# EAGLE design FREENFET3 (EAGLE 6.5.0)
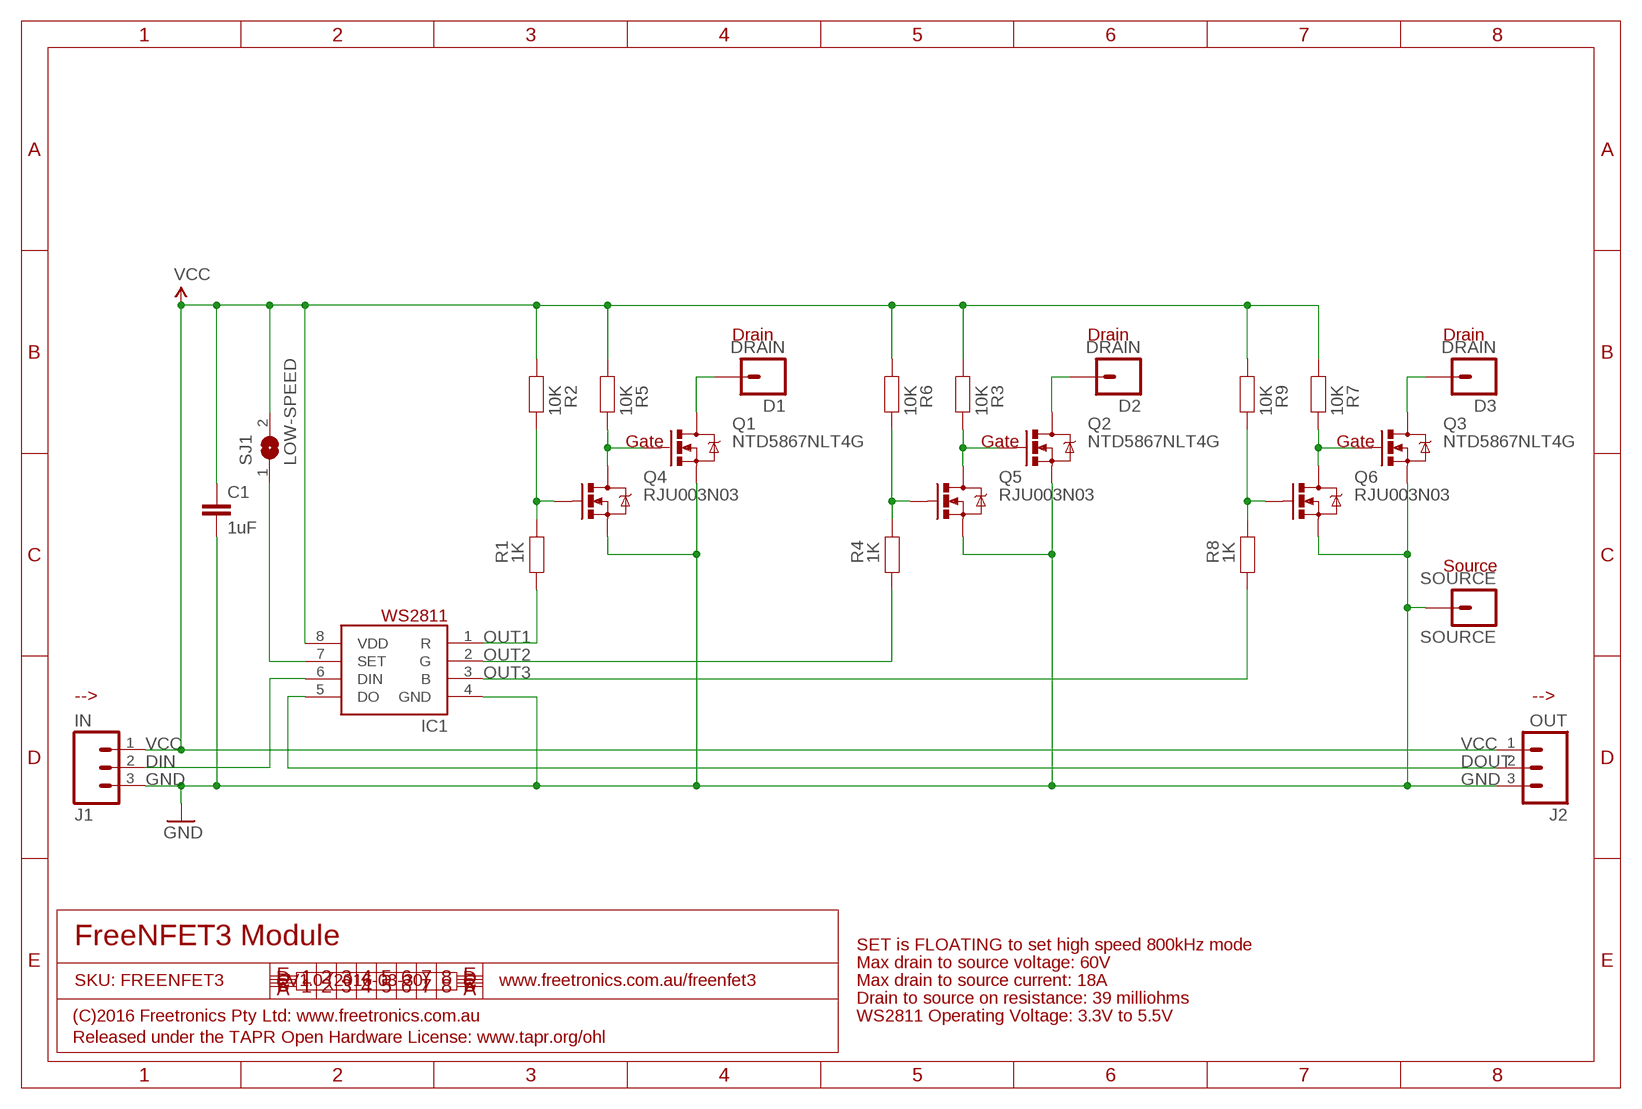
[diagram p0: schematic, sheet 1]

## Parts
C1  1uF  CAP0603  [0603]
D1  DRAIN  M01PTH_LARGE  [1X01LARGE]
D2  DRAIN  M01PTH_LARGE  [1X01LARGE]
D3  DRAIN  M01PTH_LARGE  [1X01LARGE]
IC1  WS2811-SOP8  [SO08-SKINNYPADS]
J1  IN  M03PTH  [1X03]
J2  OUT  M03PTH  [1X03]
Q1  NTD5867NLT4G  MOSFET-NCHANNELDPAK  [DPACK]
Q2  NTD5867NLT4G  MOSFET-NCHANNELDPAK  [DPACK]
Q3  NTD5867NLT4G  MOSFET-NCHANNELDPAK  [DPACK]
Q4  RJU003N03  MOSFET-NSOT-323  [SOT32-3]
Q5  RJU003N03  MOSFET-NSOT-323  [SOT32-3]
Q6  RJU003N03  MOSFET-NSOT-323  [SOT32-3]
R1  1K  RESISTOR0603  [0603]
R2  10K  RESISTOR0603  [0603]
R3  10K  RESISTOR0603  [0603]
R4  1K  RESISTOR0603  [0603]
R5  10K  RESISTOR0603  [0603]
R6  10K  RESISTOR0603  [0603]
R7  10K  RESISTOR0603  [0603]
R8  1K  RESISTOR0603  [0603]
R9  10K  RESISTOR0603  [0603]
SJ1  LOW-SPEED  SJN  [SJ]
SOURCE  SOURCE  M01PTH_LARGE  [1X01LARGE]

## Nets
D: D1.1 Q1.2(D)
D1: D2.1 Q2.2(D)
D2: D3.1 Q3.2(D)
DIN: IC1.6(DIN) J1.2
DOUT: IC1.5(DO) J2.2
GND: C1.2 IC1.4(GND) J1.3 J2.3 Q1.3(S) Q2.3(S) Q3.3(S) Q4.2(S) Q5.2(S) Q6.2(S) SOURCE.1
N$1: Q2.1(G) Q5.3(D) R3.1
N$2: Q4.1(G) R1.1 R2.1
N$3: Q1.1(G) Q4.3(D) R5.1
N$4: Q5.1(G) R4.1 R6.1
N$5: Q3.1(G) Q6.3(D) R7.1
N$6: Q6.1(G) R8.1 R9.1
N$7: IC1.7(SET) SJ1.1
OUT1: IC1.1(R) R1.2
OUT2: IC1.2(G) R4.2
OUT3: IC1.3(B) R8.2
VCC: C1.1 IC1.8(VDD) J1.1 J2.1 R2.2 R3.2 R5.2 R6.2 R7.2 R9.2 SJ1.2

## Notes on the sheet
- Drain | Drain | Drain
- Gate | Gate | Gate
- Source
- --> | -->
- FreeNFET3 Module
- SET is FLOATING to set high speed 800kHz mode
- Max drain to source voltage: 60V
- SKU: FREENFET3 | V1.0 (2016-03-30) | www.freetronics.com.au/freenfet3 | Max drain to source current: 18A
- Drain to source on resistance: 39 milliohms
- (C)2016 Freetronics Pty Ltd: www.freetronics.com.au | WS2811 Operating Voltage: 3.3V to 5.5V
- Released under the TAPR Open Hardware License: www.tapr.org/ohl

## Library data of the parts
C1 = freetronics-master-v1:CAP: Capacitor Standard 0603 ceramic capacitor, and 0.1" leaded capacitor.
D1-D3 SOURCE = freetronics-master-v1.1:M01: Header 1 Standard 1-pin 0.1" header. Use with straight break away headers (SKU : PRT-00116), right angle break away headers (PRT-00553), swiss pins (PRT-00743), machine pins (PRT-00117), and female headers (PRT-00115).
IC1 = freetronics-jon:WS2811
J1 J2 = freetronics-jon:M03: Header 3 Standard 3-pin 0.1" header. Use with straight break away headers (SKU : PRT-00116), right angle break away headers (PRT-00553), swiss pins (PRT-00743), machine pins (PRT-00117), and female headers (PRT-00115). Molex polarized connector foot print use with SKU : PRT-08232 with associated crimp pins and housings.
Q1-Q3 = freetronics-master-v1.1:MOSFET-NCHANNEL
Q4-Q6 = freetronics-jon:MOSFET-N: Basic N-Channel MOSFET
R1-R9 = freetronics-master-v1:RESISTOR: Resistor Basic schematic elements and footprints for 0603, 1206, and PTH 1/10th watt (small) resistors.
SJ1 = freetronics-jon:SJ: SMD solder JUMPER

## Board
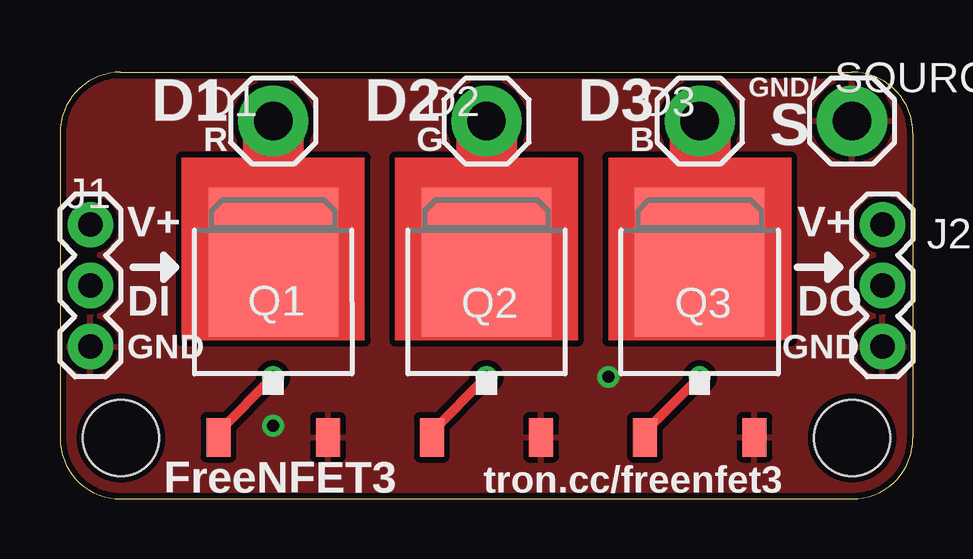
[diagram p1: board, top side]
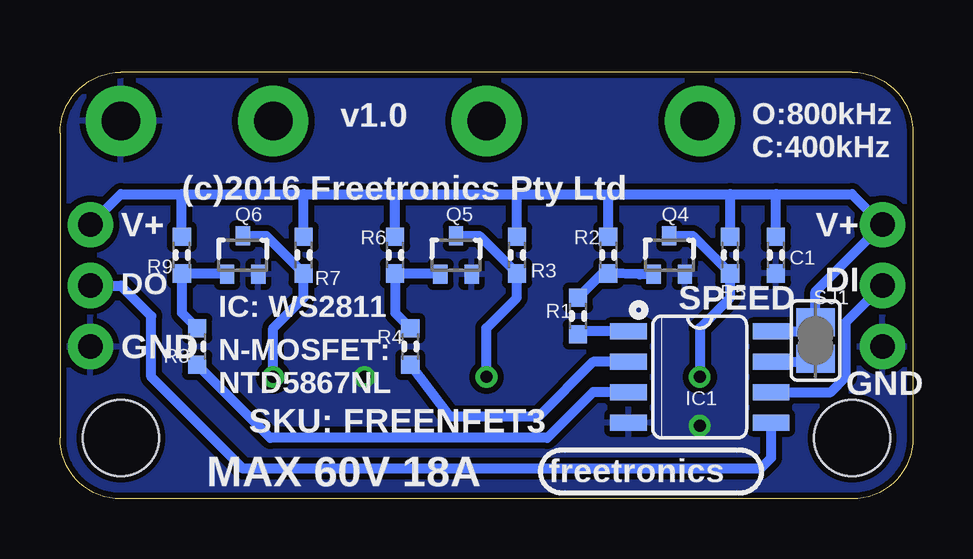
[diagram p2: board, bottom side, seen from below]

Size 35.56 x 17.78 mm. Coordinates in mm from the lower left corner, seen from the top.
Outline: 0,2.54 arc90 2.54,0 33.02,0 arc90 35.56,2.54 35.56,15.24 arc90 33.02,17.78 2.54,17.78 arc90 0,15.24 0,2.54
Copper layers (1*16): Top 0.035mm / dielectric 1.5mm / Bottom 0.035mm
Design rules "default *": minimum track width 8mil, minimum drill 15mil, track to track 10mil, track to pad 10mil, pad to pad 10mil, via to via 10mil, smd to smd 8mil, copper to edge 10mil, drill to drill 8mil, minimum pad ring 14mil, minimum via ring 8mil, stop-mask expansion 4mil, vias tented up to drill 25mil, thermal gap 10mil
Holes 3.17 mm at 2.54,2.54 33.02,2.54

### Footprints (pad centres in the part's own frame; a part is rotated, then mirrored left to right if it is on the bottom)
0603 = smd 0.762 x 0.762: 1 -0.762,0; 2 0.762,0
1X01LARGE = drill 1.6 pad 2.921: 1 0,0
SO08-SKINNYPADS = smd 0.66 x 1.524: 1 -1.905,-2.973; 2 -0.635,-2.973; 3 0.635,-2.973; 4 1.905,-2.973; 5 1.905,2.973; 6 0.635,2.973; 7 -0.635,2.973; 8 -1.905,2.973
1X03 = drill 1.016 pad 1.88: 1 0,0; 2 2.54,0; 3 5.08,0
DPACK = smd 1 x 1.6: 1 -2.28,-4.8; 3 2.28,-4.8 | smd 5.4 x 6.2: 2 0,2.5
SOT32-3 = smd 0.6 x 0.8: 1 -0.65,-0.8; 2 0.65,-0.8; 3 0,0.8
SJ = smd 1.168 x 1.6: 1 -0.762,0; 2 0.762,0

### Placement (x,y rotation side)
C1  5.71,10.16 270 bottom
D1  8.89,15.75 0 top
D2  17.78,15.75 0 top
D3  26.67,15.75 0 top
IC1  8.89,5.08 270 bottom
J1  1.27,11.43 270 top
J2  34.29,11.43 270 top
Q1  8.89,7.37 0 top
Q2  17.78,7.37 0 top
Q3  26.67,7.37 0 top
Q4  10.16,10.16 0 bottom
Q5  19.05,10.16 0 bottom
Q6  27.94,10.16 0 bottom
R1  13.97,7.62 270 bottom
R2  12.7,10.16 90 bottom
R3  16.51,10.16 90 bottom
R4  20.95,6.35 270 bottom
R5  7.62,10.16 90 bottom
R6  21.59,10.16 90 bottom
R7  25.4,10.16 90 bottom
R8  29.84,6.35 270 bottom
R9  30.48,10.16 90 bottom
SJ1  4.06,6.6 90 bottom
SOURCE  33.02,15.75 0 top

### Tracks (layer width: path | path; a pad name or v marks a point on that pad's centre or on a via)
D
  Top 0.305: 8.89,11.43 Q1.2
  Top 2.54: D1.1 8.89,11.43
D1
  Top 2.54: D2.1 Q2.2
D2
  Top 2.54: D3.1 Q3.2
DIN
  Bottom 0.406: IC1.6 3.43,4.45 2.79,5.08 2.79,7.37 J1.2
DOUT
  Bottom 0.406: IC1.5 5.92,1.7 6.35,1.27 27.94,1.27 31.75,5.08 31.75,7.62 33.02,8.89 J2.2
GND  (via drill 0.5)
  other vias: 8.89,3.05 22.86,5.08
  pour Top: 0,15.24 arc-90 2.54,17.78 33.02,17.78 arc-90 35.56,15.24 35.56,2.54 arc-90 33.02,0 2.54,0 arc-90 0,2.54
  pour Bottom: 0,15.24 arc-90 2.54,17.78 33.02,17.78 arc-90 35.56,15.24 35.56,2.54 arc-90 33.02,0 2.54,0 arc-90 0,2.54
N$1  (via drill 0.5)
  Top 0.406: Q2.1 15.5,2.8 v17.78,5.08
  Bottom 0.406: Q5.3 18.07,10.96 R3.1 16.51,8.38 17.78,7.11 v17.78,5.08
N$2
  Bottom 0.406: Q4.1 11.39,9.36 R2.1 12.95,9.4 R1.1
N$3  (via drill 0.5)
  Top 0.406: 6.35,2.54 6.61,2.54 Q1.1 6.61,2.8 v8.89,5.08
  Bottom 0.406: Q4.3 9.18,10.96 R5.1 7.62,8.38 8.89,7.11 v8.89,5.08
N$4
  Bottom 0.406: Q5.1 19.74,9.4 R6.1 21.59,7.75 R4.1
N$5  (via drill 0.5)
  Top 0.406: v26.67,5.08 24.39,2.8 Q3.1
  Bottom 0.406: Q6.3 26.96,10.96 R7.1 25.4,8.38 26.67,7.11 v26.67,5.08
N$6
  Bottom 0.406: Q6.1 28.63,9.4 R9.1 30.48,7.75 R8.1
N$7
  Bottom 0.406: IC1.7 4.19,5.71 SJ1.1
OUT1
  Bottom 0.406: IC1.1 13.84,6.99 R1.2
OUT2
  Bottom 0.406: IC1.2 13.34,5.71 15.62,3.43 19.3,3.43 R4.2
OUT3
  Bottom 0.406: IC1.3 13.34,4.45 15.24,2.54 26.8,2.54 R8.2
VCC
  Bottom 0.406: J2.1 33.02,12.7 30.48,12.7 | 30.48,12.7 25.4,12.7 | 25.4,12.7 21.59,12.7 | 21.59,12.7 16.51,12.7 | 16.51,12.7 12.7,12.7 | 12.7,12.7 7.62,12.7 | 7.62,12.7 5.71,12.7 | 5.71,12.7 2.54,12.7 J1.1 4.06,8.64 SJ1.2 4.45,6.99 IC1.8 | R9.2 30.48,12.7 | R7.2 25.4,12.7 | R6.2 21.59,12.7 | R3.2 16.51,12.7 | R2.2 12.7,12.7 | R5.2 7.62,12.7 | C1.1 5.71,12.7
(copper drawn outside any net)
  shapes: Top area x3

### Text on the board
tPlace: GND/ | D1 | D2 | D3 | S | R | G | B | V+ | V+ | DI | DO | GND | GND | FreeNFET3 | tron.cc/freenfet3
bPlace: v1.0 | O:800kHz / C:400kHz | (c)2016 Freetronics Pty Ltd | V+ | V+ | DI | DO | SPEED | IC: WS2811 | GND | GND | N-MOSFET: / NTD5867NL | SKU: FREENFET3 | freetronics | MAX 60V 18A